# EAGLE schematic TAStm32_v2 (EAGLE 9.1.3)
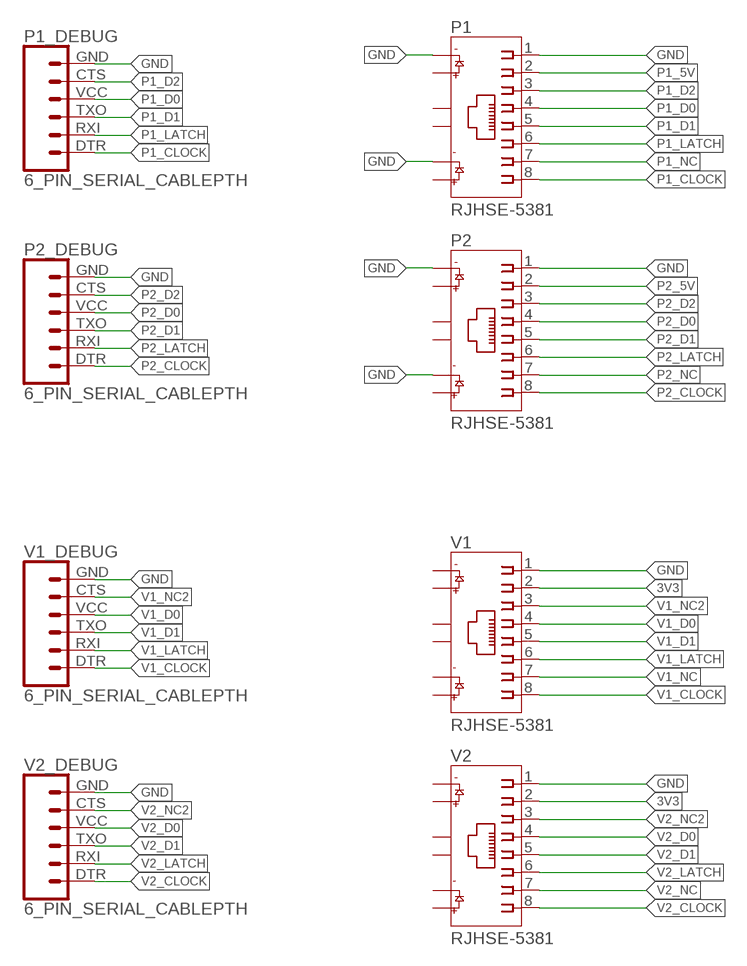
[diagram p0: schematic, sheet 1, part 1 of 2]
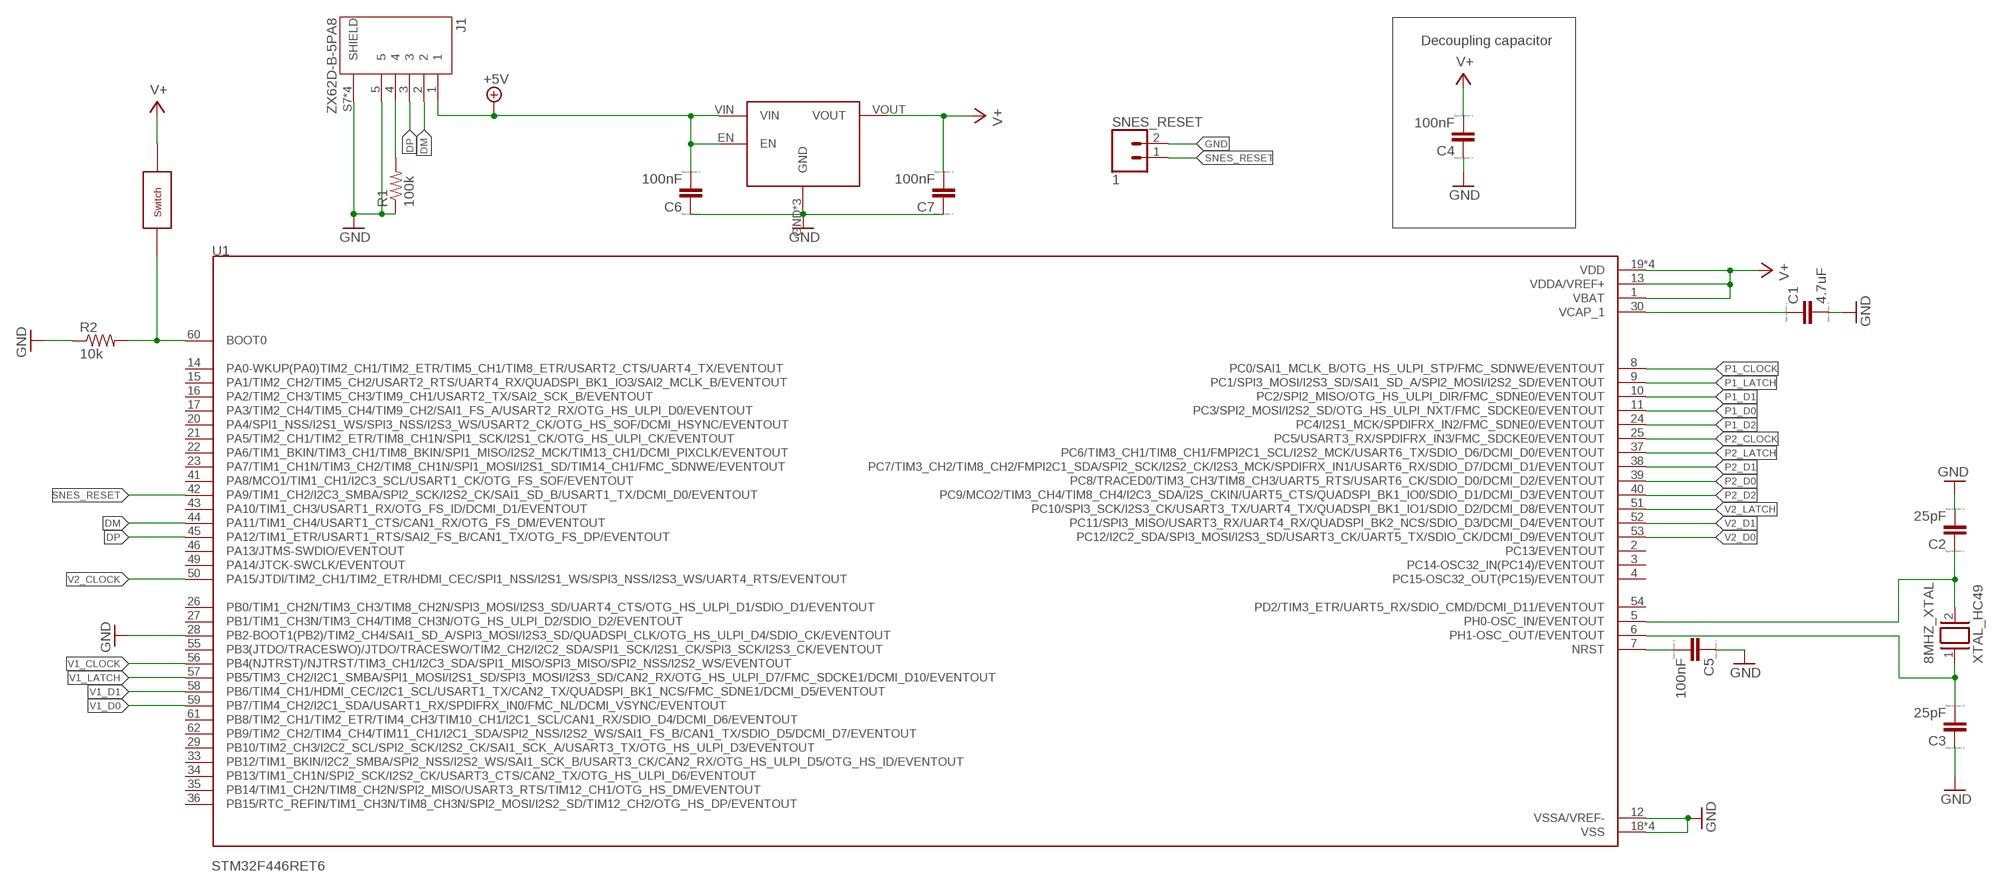
[diagram p1: schematic, sheet 1, part 2 of 2]

## Parts
8MHZ_XTAL  XTAL_HC49  [XTAL_HC49P488W45L1150T500H350]
C1  4.7uF  C  [C0805]
C2  25pF  C  [C0805]
C3  25pF  C  [C0805]
C4  100nF  C  [C0805]
C5  100nF  C  [C0805]
C6  100nF  C  [C0805]
C7  100nF  C  [C0805]
J1  ZX62D-B-5PA8  [HIROSE_ZX62D-B-5PA8]
P1  RJHSE-5381  [AMPHENOL_RJHSE-5381]
P1_DEBUG  6_PIN_SERIAL_CABLEPTH  [FTDI_BASIC]
P2  RJHSE-5381  [AMPHENOL_RJHSE-5381]
P2_DEBUG  6_PIN_SERIAL_CABLEPTH  [FTDI_BASIC]
R1  100k  R-US_R0805  [R0805]
R2  10k  R-US_R0805  [R0805]
SNES_RESET  1  CONN_02  [1X02]
SWITCH  DM01  [DM01]
U1  STM32F446RET6  [QFP50P1200X1200X160-64N]
V1  RJHSE-5381  [AMPHENOL_RJHSE-5381]
V1_DEBUG  6_PIN_SERIAL_CABLEPTH  [FTDI_BASIC]
V2  RJHSE-5381  [AMPHENOL_RJHSE-5381]
V2_DEBUG  6_PIN_SERIAL_CABLEPTH  [FTDI_BASIC]
V_REG  S-1172B33-U5T1G  [S-1172B33-U5T1G]

## Nets
3V3: C4.2 C7.2 SWITCH.P$1 U1.1(VBAT) U1.13(VDDA/VREF+) U1.19(VDD) U1.32(VDD) U1.48(VDD) U1.64(VDD) V1.2 V2.2 V_REG.VOUT ; supply symbol labelled V+
+5V: C6.2 J1.1 V_REG.EN V_REG.VIN
DM: J1.2 U1.44(PA11/TIM1_CH4/USART1_CTS/CAN1_RX/OTG_FS_DM/EVENTOUT)
DP: J1.3 U1.45(PA12/TIM1_ETR/USART1_RTS/SAI2_FS_B/CAN1_TX/OTG_FS_DP/EVENTOUT)
GND: C1.2 C2.2 C3.1 C4.1 C5.1 C6.1 C7.1 J1.5 J1.S7(SHIELD) J1.S8(SHIELD) J1.S9(SHIELD) J1.S10(SHIELD) P1.1 P1.9 P1.11 P1_DEBUG.GND P2.1 P2.9 P2.11 P2_DEBUG.GND R1.1 R2.1 SNES_RESET.2 U1.12(VSSA/VREF-) U1.18(VSS) U1.28(PB2-BOOT1(PB2)/TIM2_CH4/SAI1_SD_A/SPI3_MOSI/I2S3_SD/QUADSPI_CLK/OTG_HS_ULPI_D4/SDIO_CK/EVENTOUT) U1.31(VSS) U1.47(VSS) U1.63(VSS) V1.1 V1_DEBUG.GND V2.1 V2_DEBUG.GND V_REG.GND V_REG.GND2(GND) V_REG.GND3(GND)
N$3: R2.2 SWITCH.P$2 U1.60(BOOT0)
N$4: C5.2 U1.7(NRST)
N$6: C1.1 U1.30(VCAP_1)
N$15: J1.4 R1.2
P1_5V: P1.2
P1_CLOCK: P1.8 P1_DEBUG.DTR U1.8(PC0/SAI1_MCLK_B/OTG_HS_ULPI_STP/FMC_SDNWE/EVENTOUT)
P1_D0: P1.4 P1_DEBUG.VCC U1.11(PC3/SPI2_MOSI/I2S2_SD/OTG_HS_ULPI_NXT/FMC_SDCKE0/EVENTOUT)
P1_D1: P1.5 P1_DEBUG.TXO U1.10(PC2/SPI2_MISO/OTG_HS_ULPI_DIR/FMC_SDNE0/EVENTOUT)
P1_D2: P1.3 P1_DEBUG.CTS U1.24(PC4/I2S1_MCK/SPDIFRX_IN2/FMC_SDNE0/EVENTOUT)
P1_LATCH: P1.6 P1_DEBUG.RXI U1.9(PC1/SPI3_MOSI/I2S3_SD/SAI1_SD_A/SPI2_MOSI/I2S2_SD/EVENTOUT)
P1_NC: P1.7
P2_5V: P2.2
P2_CLOCK: P2.8 P2_DEBUG.DTR U1.25(PC5/USART3_RX/SPDIFRX_IN3/FMC_SDCKE0/EVENTOUT)
P2_D0: P2.4 P2_DEBUG.VCC U1.39(PC8/TRACED0/TIM3_CH3/TIM8_CH3/UART5_RTS/USART6_CK/SDIO_D0/DCMI_D2/EVENTOUT)
P2_D1: P2.5 P2_DEBUG.TXO U1.38(PC7/TIM3_CH2/TIM8_CH2/FMPI2C1_SDA/SPI2_SCK/I2S2_CK/I2S3_MCK/SPDIFRX_IN1/USART6_RX/SDIO_D7/DCMI_D1/EVENTOUT)
P2_D2: P2.3 P2_DEBUG.CTS U1.40(PC9/MCO2/TIM3_CH4/TIM8_CH4/I2C3_SDA/I2S_CKIN/UART5_CTS/QUADSPI_BK1_IO0/SDIO_D1/DCMI_D3/EVENTOUT)
P2_LATCH: P2.6 P2_DEBUG.RXI U1.37(PC6/TIM3_CH1/TIM8_CH1/FMPI2C1_SCL/I2S2_MCK/USART6_TX/SDIO_D6/DCMI_D0/EVENTOUT)
P2_NC: P2.7
SNES_RESET: SNES_RESET.1 U1.42(PA9/TIM1_CH2/I2C3_SMBA/SPI2_SCK/I2S2_CK/SAI1_SD_B/USART1_TX/DCMI_D0/EVENTOUT)
V1_CLOCK: U1.56(PB4(NJTRST)/NJTRST/TIM3_CH1/I2C3_SDA/SPI1_MISO/SPI3_MISO/SPI2_NSS/I2S2_WS/EVENTOUT) V1.8 V1_DEBUG.DTR
V1_D0: U1.59(PB7/TIM4_CH2/I2C1_SDA/USART1_RX/SPDIFRX_IN0/FMC_NL/DCMI_VSYNC/EVENTOUT) V1.4 V1_DEBUG.VCC
V1_D1: U1.58(PB6/TIM4_CH1/HDMI_CEC/I2C1_SCL/USART1_TX/CAN2_TX/QUADSPI_BK1_NCS/FMC_SDNE1/DCMI_D5/EVENTOUT) V1.5 V1_DEBUG.TXO
V1_LATCH: U1.57(PB5/TIM3_CH2/I2C1_SMBA/SPI1_MOSI/I2S1_SD/SPI3_MOSI/I2S3_SD/CAN2_RX/OTG_HS_ULPI_D7/FMC_SDCKE1/DCMI_D10/EVENTOUT) V1.6 V1_DEBUG.RXI
V1_NC: V1.7
V1_NC2: V1.3 V1_DEBUG.CTS
V2_CLOCK: U1.50(PA15/JTDI/TIM2_CH1/TIM2_ETR/HDMI_CEC/SPI1_NSS/I2S1_WS/SPI3_NSS/I2S3_WS/UART4_RTS/EVENTOUT) V2.8 V2_DEBUG.DTR
V2_D0: U1.53(PC12/I2C2_SDA/SPI3_MOSI/I2S3_SD/USART3_CK/UART5_TX/SDIO_CK/DCMI_D9/EVENTOUT) V2.4 V2_DEBUG.VCC
V2_D1: U1.52(PC11/SPI3_MISO/USART3_RX/UART4_RX/QUADSPI_BK2_NCS/SDIO_D3/DCMI_D4/EVENTOUT) V2.5 V2_DEBUG.TXO
V2_LATCH: U1.51(PC10/SPI3_SCK/I2S3_CK/USART3_TX/UART4_TX/QUADSPI_BK1_IO1/SDIO_D2/DCMI_D8/EVENTOUT) V2.6 V2_DEBUG.RXI
V2_NC: V2.7
V2_NC2: V2.3 V2_DEBUG.CTS
XTAL1: 8MHZ_XTAL.2 C2.1 U1.5(PH0-OSC_IN/EVENTOUT)
XTAL2: 8MHZ_XTAL.1 C3.2 U1.6(PH1-OSC_OUT/EVENTOUT)
Unconnected: P1.10 P1.12 P1.S1 P1.S2 P2.10 P2.12 P2.S1 P2.S2 U1.2(PC13/EVENTOUT) U1.3(PC14-OSC32_IN(PC14)/EVENTOUT) U1.4(PC15-OSC32_OUT(PC15)/EVENTOUT) U1.14(PA0-WKUP(PA0)TIM2_CH1/TIM2_ETR/TIM5_CH1/TIM8_ETR/USART2_CTS/UART4_TX/EVENTOUT) U1.15(PA1/TIM2_CH2/TIM5_CH2/USART2_RTS/UART4_RX/QUADSPI_BK1_IO3/SAI2_MCLK_B/EVENTOUT) U1.16(PA2/TIM2_CH3/TIM5_CH3/TIM9_CH1/USART2_TX/SAI2_SCK_B/EVENTOUT) U1.17(PA3/TIM2_CH4/TIM5_CH4/TIM9_CH2/SAI1_FS_A/USART2_RX/OTG_HS_ULPI_D0/EVENTOUT) U1.20(PA4/SPI1_NSS/I2S1_WS/SPI3_NSS/I2S3_WS/USART2_CK/OTG_HS_SOF/DCMI_HSYNC/EVENTOUT) U1.21(PA5/TIM2_CH1/TIM2_ETR/TIM8_CH1N/SPI1_SCK/I2S1_CK/OTG_HS_ULPI_CK/EVENTOUT) U1.22(PA6/TIM1_BKIN/TIM3_CH1/TIM8_BKIN/SPI1_MISO/I2S2_MCK/TIM13_CH1/DCMI_PIXCLK/EVENTOUT) U1.23(PA7/TIM1_CH1N/TIM3_CH2/TIM8_CH1N/SPI1_MOSI/I2S1_SD/TIM14_CH1/FMC_SDNWE/EVENTOUT) U1.26(PB0/TIM1_CH2N/TIM3_CH3/TIM8_CH2N/SPI3_MOSI/I2S3_SD/UART4_CTS/OTG_HS_ULPI_D1/SDIO_D1/EVENTOUT) U1.27(PB1/TIM1_CH3N/TIM3_CH4/TIM8_CH3N/OTG_HS_ULPI_D2/SDIO_D2/EVENTOUT) U1.29(PB10/TIM2_CH3/I2C2_SCL/SPI2_SCK/I2S2_CK/SAI1_SCK_A/USART3_TX/OTG_HS_ULPI_D3/EVENTOUT) U1.33(PB12/TIM1_BKIN/I2C2_SMBA/SPI2_NSS/I2S2_WS/SAI1_SCK_B/USART3_CK/CAN2_RX/OTG_HS_ULPI_D5/OTG_HS_ID/EVENTOUT) U1.34(PB13/TIM1_CH1N/SPI2_SCK/I2S2_CK/USART3_CTS/CAN2_TX/OTG_HS_ULPI_D6/EVENTOUT) U1.35(PB14/TIM1_CH2N/TIM8_CH2N/SPI2_MISO/USART3_RTS/TIM12_CH1/OTG_HS_DM/EVENTOUT) U1.36(PB15/RTC_REFIN/TIM1_CH3N/TIM8_CH3N/SPI2_MOSI/I2S2_SD/TIM12_CH2/OTG_HS_DP/EVENTOUT) U1.41(PA8/MCO1/TIM1_CH1/I2C3_SCL/USART1_CK/OTG_FS_SOF/EVENTOUT) U1.43(PA10/TIM1_CH3/USART1_RX/OTG_FS_ID/DCMI_D1/EVENTOUT) U1.46(PA13/JTMS-SWDIO/EVENTOUT) U1.49(PA14/JTCK-SWCLK/EVENTOUT) U1.54(PD2/TIM3_ETR/UART5_RX/SDIO_CMD/DCMI_D11/EVENTOUT) U1.55(PB3(JTDO/TRACESWO)/JTDO/TRACESWO/TIM2_CH2/I2C2_SDA/SPI1_SCK/I2S1_CK/SPI3_SCK/I2S3_CK/EVENTOUT) U1.61(PB8/TIM2_CH1/TIM2_ETR/TIM4_CH3/TIM10_CH1/I2C1_SCL/CAN1_RX/SDIO_D4/DCMI_D6/EVENTOUT) U1.62(PB9/TIM2_CH2/TIM4_CH4/TIM11_CH1/I2C1_SDA/SPI2_NSS/I2S2_WS/SAI1_FS_B/CAN1_TX/SDIO_D5/DCMI_D7/EVENTOUT) V1.9 V1.10 V1.11 V1.12 V1.S1 V1.S2 V2.9 V2.10 V2.11 V2.12 V2.S1 V2.S2

## Notes on the sheet
- Decoupling capacitor

## Library data of the parts
8MHZ_XTAL = XTAL_HC49P488W45L1150T500H350:XTAL_HC49
C1-C7 = eagle-ltspice:C: CAPACITOR, European symbol; SPICEMODEL: NONE; SPICEPREFIX: C
J1 = ZX62D-B-5PA8:ZX62D-B-5PA8: CONN RCPT USB; AVAILABILITY: Unavailable; DESCRIPTION: 5 Pin Single Port USB 2.0 Micro B Bottom Mount Through Hole Receptacle Male; MF: Hirose; MP: ZX62D-B-5PA8; PACKAGE: None; PRICE: None
P1 P2 V1 V2 = RJHSE-5381:RJHSE-5381: connector, mod jack, rt angle pcb, shielded, led1-g, led2-y, single port, rj-45 8 cont; AVAILABILITY: Unavailable; DESCRIPTION: connector, mod jack, rt angle pcb, shielded, led1-g, led2-y, single port, rj-45 8 cont; MF: Amphenol ICC; MP: RJHSE-5381; PACKAGE: None; PRICE: None
P1_DEBUG P2_DEBUG V1_DEBUG V2_DEBUG = SparkFun-Connectors:6_PIN_SERIAL_CABLE: 6-pin header connection for use with the "FTDI BASIC" pinout - CABLE SIDE. Also known as "Arduino Serial Program Header". This is used on a design to provide a 6-pin connection point for serial communication usually from a USB cable (D+/D-) to these headers (RX/TX). It also has the remaining pins necessary for programming in the Arduino evironment (DTR, GND, and sometimes VCC). Note, this device has "CABLE" in the name. It is intended to be used on a design that usually lives on the end of your USB cable and prvides the converter chip (FTDI232 or FTDI231x) to commnicate serial RX/TX. The "sister" device, named "TARGET" is inteneded to be used on a design that contains a target micro-controller that you wish to program. You can populate with some of these: Female Headers <https://www.sparkfun.com/products/115> (PRT-00115) For reference (or to suit your programming needs) check out these designs: SparkFun FTDI Basic Breakout - 5V <https://www.sparkfun.com/products/9716> (DEV-09716) SparkFun FTDI Basic Breakout - 3.3V <https://www.sparkfun.com/products/9873> (DEV-09873) SparkFun FTDI SmartBasic <https://www.sparkfun.com/products/12935> (DEV-12935) SparkFun Beefy 3 - FTDI Basic Breakout <https://www.sparkfun.com/products/13746> (DEV-13746)
R1 R2 = rcl:R-US_: RESISTOR, American symbol; SPICEPREFIX: R
SNES_RESET = SparkFun-Connectors:CONN_02: Multi connection point. Often used as Generic Header-pin footprint for 0.1 inch spaced/style header connections On any of the 0.1 inch spaced packages, you can populate with these: Break Away Headers - Straight <https://www.sparkfun.com/products/116> (PRT-00116) Break Away Male Headers - Right Angle <https://www.sparkfun.com/products/553> (PRT-00553) Female Headers <https://www.sparkfun.com/products/115> (PRT-00115) Break Away Headers - Machine Pin <https://www.sparkfun.com/products/117> (PRT-00117) Break Away Female Headers - Swiss Machine Pin <https://www.sparkfun.com/products/743> (PRT-00743) For SCREWTERMINALS and SPRING TERMINALS visit here: Screw Terimnals on SparkFun.com <https://www.sparkfun.com/search/results?term=Screw+Terminals> (5mm/3.5mm/2.54mm spacing) This device is also useful as a general connection point to wire up your design to another part of your project. Our various solder wires solder well into these plated through hole pads. Hook-Up Wire - Assortment (Stranded, 22 AWG) <https://www.sparkfun.com/products/11375> (PRT-11375) Hook-Up Wire - Assortment (Solid Core, 22 AWG) <https://www.sparkfun.com/products/11367> (PRT-11367) View the entire wire category on our website here <https://www.sparkfun.com/categories/141> Special notes: Molex polarized connector foot print use with: PRT-08233 with associated crimp pins and housings. 2.54_SCREWTERM for use with PRT-10571. 3.5mm Screw Terminal footprints for PRT-08084 5mm Screw Terminal footprints for use with PRT-08432
SWITCH = DM01:DM01
U1 = STM32F446RET6:STM32F446RET6: MCU 32-Bit STM32 ARM Cortex M4 RISC 512KB Flash 2.5V/3.3V 64-Pin LQFP Tray; DESCRIPTION: MCU 32-Bit STM32 ARM Cortex M4 RISC 512KB Flash 2.5V/3.3V 64-Pin LQFP Tray; MF: STMicroelectronics; MP: STM32F446RET6; PACKAGE: LQFP-64 STMicroelectronics
V_REG = S-1172B33-U5T1G:S-1172B33-U5T1G